# EAGLE design teensy_adapter (EAGLE 9.0.1)
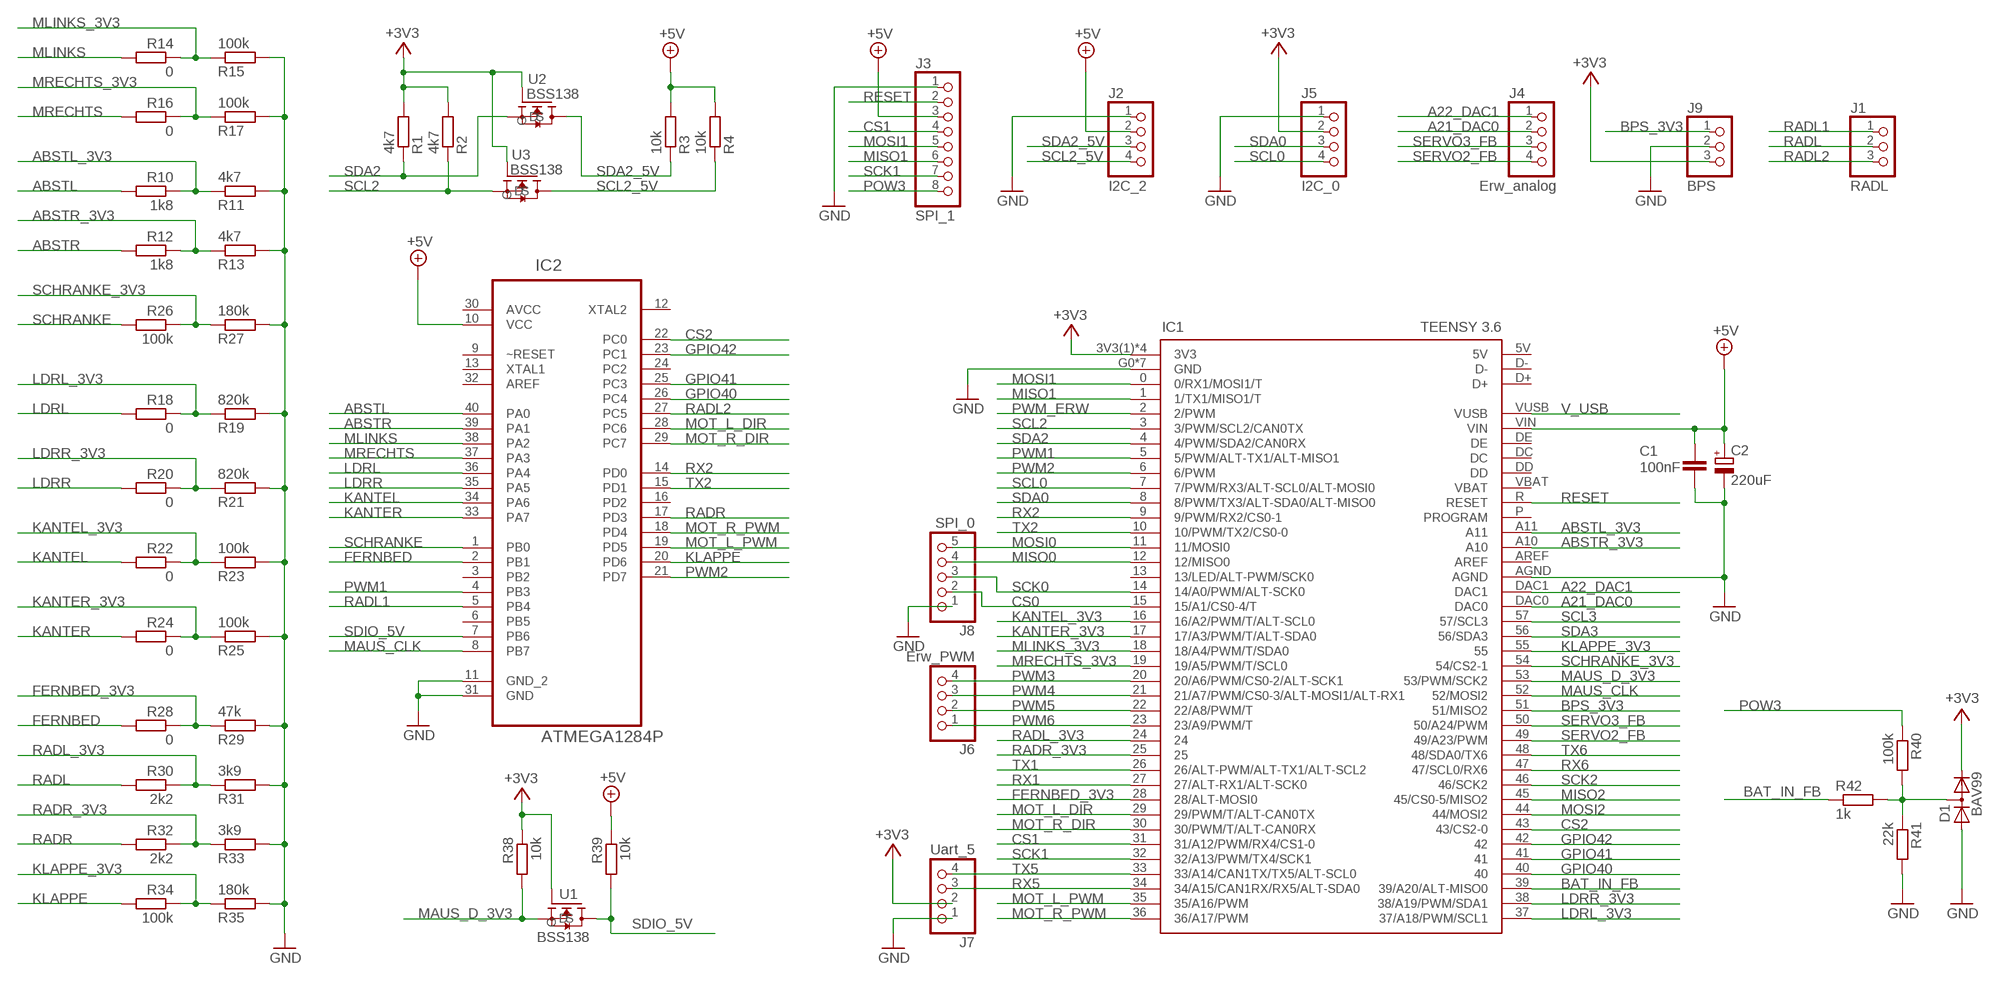
[diagram p0: schematic, sheet 1]

## Parts
C1  100nF  C-EU025-025X050  [C025-025X050]
C2  220uF  CPOL-EUE2.5-6  [E2,5-6]
D1  BAV99  BAV199  [SOT23]
IC1  TEENSY 3.6  TEENSY3_6--ALLPINS  [T36]
IC2  ATMEGA1284P  ATMEGA1284P-PU  [DIP254P1524X483-40]
J1  RADL  PINHD-1X3  [1X03]
J2  I2C_2  PINHD-1X4  [1X04]
J3  SPI_1  PINHD-1X8  [1X08]
J4  Erw_analog  PINHD-1X4  [1X04]
J5  I2C_0  PINHD-1X4  [1X04]
J6  Erw_PWM  PINHD-1X4  [1X04]
J7  Uart_5  PINHD-1X4  [1X04]
J8  SPI_0  PINHD-1X5  [1X05]
J9  BPS  PINHD-1X3  [1X03]
R1  4k7  R-EU_0204/2V  [0204V]
R2  4k7  R-EU_0204/2V  [0204V]
R3  10k  R-EU_0204/2V  [0204V]
R4  10k  R-EU_0204/2V  [0204V]
R10  1k8  R-EU_0204/2V  [0204V]
R11  4k7  R-EU_0204/2V  [0204V]
R12  1k8  R-EU_0204/2V  [0204V]
R13  4k7  R-EU_0204/2V  [0204V]
R14  0  R-EU_0204/2V  [0204V]
R15  100k  R-EU_0204/2V  [0204V]
R16  0  R-EU_0204/2V  [0204V]
R17  100k  R-EU_0204/2V  [0204V]
R18  0  R-EU_0204/2V  [0204V]
R19  820k  R-EU_0204/2V  [0204V]
R20  0  R-EU_0204/2V  [0204V]
R21  820k  R-EU_0204/2V  [0204V]
R22  0  R-EU_0204/2V  [0204V]
R23  100k  R-EU_0204/2V  [0204V]
R24  0  R-EU_0204/2V  [0204V]
R25  100k  R-EU_0204/2V  [0204V]
R26  100k  R-EU_0204/2V  [0204V]
R27  180k  R-EU_0204/2V  [0204V]
R28  0  R-EU_0204/2V  [0204V]
R29  47k  R-EU_0204/2V  [0204V]
R30  2k2  R-EU_0204/2V  [0204V]
R31  3k9  R-EU_0204/2V  [0204V]
R32  2k2  R-EU_0204/2V  [0204V]
R33  3k9  R-EU_0204/2V  [0204V]
R34  100k  R-EU_0204/2V  [0204V]
R35  180k  R-EU_0204/2V  [0204V]
R38  10k  R-EU_0204/2V  [0204V]
R39  10k  R-EU_0204/2V  [0204V]
R40  100k  R-EU_0204/2V  [0204V]
R41  22k  R-EU_0204/2V  [0204V]
R42  1k  R-EU_0204/2V  [0204V]
U1  BSS138  [BSS138]
U2  BSS138  [BSS138]
U3  BSS138  [BSS138]

## Nets
+3V3: D1.2(C) IC1.3V3(1)(3V3) IC1.3V3(2)(3V3) IC1.3V3(3)(3V3) IC1.3V3(4)(3V3) J5.2 J7.2 J9.3 R1.2 R2.2 R38.1 U1.G U2.G U3.G
+5V: C1.1 C2.+ IC1.VIN IC2.10(VCC) J2.2 J3.3 R3.2 R4.2 R39.1
A21_DAC0: IC1.DAC0 J4.2
A22_DAC1: IC1.DAC1 J4.1
ABSTL: IC2.40(PA0) R10.2
ABSTL_3V3: IC1.A11 R10.1 R11.1
ABSTR: IC2.39(PA1) R12.2
ABSTR_3V3: IC1.A10 R12.1 R13.1
BAT_IN_FB: IC1.39(39/A20/ALT-MISO0) R42.1
BPS_3V3: IC1.51(51/MISO2) J9.1
CS0: IC1.15(15/A1/CS0-4/T) J8.2
CS1: IC1.31(31/A12/PWM/RX4/CS1-0) J3.4
CS2: IC1.43(43/CS2-0) IC2.22(PC0)
FERNBED: IC2.2(PB1) R28.2
FERNBED_3V3: IC1.28(28/ALT-MOSI0) R28.1 R29.1
GND: C1.2 C2.- D1.1(A) IC1.AGND IC1.G0(GND) IC1.G1(GND) IC1.G2(GND) IC1.G3(GND) IC1.G4(GND) IC1.G5(GND) IC1.G6(GND) IC2.11(GND_2) IC2.31(GND) J2.1 J3.1 J5.1 J7.1 J8.1 J9.2 R11.2 R13.2 R15.2 R17.2 R19.2 R21.2 R23.2 R25.2 R27.2 R29.2 R31.2 R33.2 R35.2 R41.2
GPIO40: IC1.40 IC2.26(PC4)
GPIO41: IC1.41 IC2.25(PC3)
GPIO42: IC1.42 IC2.23(PC1)
KANTEL: IC2.34(PA6) R22.2
KANTEL_3V3: IC1.16(16/A2/PWM/T/ALT-SCL0) R22.1 R23.1
KANTER: IC2.33(PA7) R24.2
KANTER_3V3: IC1.17(17/A3/PWM/T/ALT-SDA0) R24.1 R25.1
KLAPPE: IC2.20(PD6) R34.2
KLAPPE_3V3: IC1.55 R34.1 R35.1
LDRL: IC2.36(PA4) R18.2
LDRL_3V3: IC1.37(37/A18/PWM/SCL1) R18.1 R19.1
LDRR: IC2.35(PA5) R20.2
LDRR_3V3: IC1.38(38/A19/PWM/SDA1) R20.1 R21.1
MAUS_CLK: IC1.52(52/MOSI2) IC2.8(PB7)
MAUS_D_3V3: IC1.53(53/PWM/SCK2) R38.2 U1.S
MISO0: IC1.12(12/MISO0) J8.4
MISO1: IC1.1(1/TX1/MISO1/T) J3.6
MISO2: IC1.45(45/CS0-5/MISO2)
MLINKS: IC2.38(PA2) R14.2
MLINKS_3V3: IC1.18(18/A4/PWM/T/SDA0) R14.1 R15.1
MOSI0: IC1.11(11/MOSI0) J8.5
MOSI1: IC1.0(0/RX1/MOSI1/T) J3.5
MOSI2: IC1.44(44/MOSI2)
MOT_L_DIR: IC1.29(29/PWM/T/ALT-CAN0TX) IC2.28(PC6)
MOT_L_PWM: IC1.35(35/A16/PWM) IC2.19(PD5)
MOT_R_DIR: IC1.30(30/PWM/T/ALT-CAN0RX) IC2.29(PC7)
MOT_R_PWM: IC1.36(36/A17/PWM) IC2.18(PD4)
MRECHTS: IC2.37(PA3) R16.2
MRECHTS_3V3: IC1.19(19/A5/PWM/T/SCL0) R16.1 R17.1
N$4: D1.3(AC) R40.2 R41.1 R42.2
POW3: J3.8 R40.1
PWM1: IC1.5(5/PWM/ALT-TX1/ALT-MISO1) IC2.4(PB3)
PWM2: IC1.6(6/PWM) IC2.21(PD7)
PWM3: IC1.20(20/A6/PWM/CS0-2/ALT-SCK1) J6.4
PWM4: IC1.21(21/A7/PWM/CS0-3/ALT-MOSI1/ALT-RX1) J6.3
PWM5: IC1.22(22/A8/PWM/T) J6.2
PWM6: IC1.23(23/A9/PWM/T) J6.1
PWM_ERW: IC1.2(2/PWM)
RADL: J1.2 R30.2
RADL1: IC2.5(PB4) J1.1
RADL2: IC2.27(PC5) J1.3
RADL_3V3: IC1.24 R30.1 R31.1
RADR: IC2.17(PD3) R32.2
RADR_3V3: IC1.25 R32.1 R33.1
RESET: IC1.R(RESET) J3.2
RX1: IC1.27(27/ALT-RX1/ALT-SCK0)
RX2: IC1.9(9/PWM/RX2/CS0-1) IC2.14(PD0)
RX5: IC1.34(34/A15/CAN1RX/RX5/ALT-SDA0) J7.3
RX6: IC1.47(47/SCL0/RX6)
SCHRANKE: IC2.1(PB0) R26.2
SCHRANKE_3V3: IC1.54(54/CS2-1) R26.1 R27.1
SCK0: IC1.14(14/A0/PWM/ALT-SCK0) J8.3
SCK1: IC1.32(32/A13/PWM/TX4/SCK1) J3.7
SCK2: IC1.46(46/SCK2)
SCL0: IC1.7(7/PWM/RX3/ALT-SCL0/ALT-MOSI0) J5.4
SCL2: IC1.3(3/PWM/SCL2/CAN0TX) R2.1 U3.S
SCL2_5V: J2.4 R4.1 U3.D
SCL3: IC1.57(57/SCL3)
SDA0: IC1.8(8/PWM/TX3/ALT-SDA0/ALT-MISO0) J5.3
SDA2: IC1.4(4/PWM/SDA2/CAN0RX) R1.1 U2.S
SDA2_5V: J2.3 R3.1 U2.D
SDA3: IC1.56(56/SDA3)
SDIO_5V: IC2.7(PB6) R39.2 U1.D
SERVO2_FB: IC1.49(49/A23/PWM) J4.4
SERVO3_FB: IC1.50(50/A24/PWM) J4.3
TX1: IC1.26(26/ALT-PWM/ALT-TX1/ALT-SCL2)
TX2: IC1.10(10/PWM/TX2/CS0-0) IC2.15(PD1)
TX5: IC1.33(33/A14/CAN1TX/TX5/ALT-SCL0) J7.4
TX6: IC1.48(48/SDA0/TX6)
V_USB: IC1.VUSB
Unconnected: IC1.5V IC1.13(13/LED/ALT-PWM/SCK0) IC1.AREF IC1.D+ IC1.D- IC1.DC IC1.DD IC1.DE IC1.P(PROGRAM) IC1.VBAT IC2.3(PB2) IC2.6(PB5) IC2.9(~RESET) IC2.12(XTAL2) IC2.13(XTAL1) IC2.16(PD2) IC2.24(PC2) IC2.32(AREF)

## Power pins joined to a net without a drawn wire
AVCC: IC2.30(AVCC)

## Library data of the parts
C1 = rcl:C-EU: CAPACITOR, European symbol; SPICEPREFIX: C
C2 = rcl:CPOL-EU: POLARIZED CAPACITOR, European symbol; SPICEPREFIX: C
D1 = diode:BAV199: DIODE low-leakage double diode
IC1 = Teensy_3_6:TEENSY3_6--ALLPINS
IC2 = Atmel_By_element14_Batch_1:ATMEGA1284P-PU: 8-bit Microcontroller with In-System Programmable Flash; MPN: ATMEGA1284P-PU; OC_FARNELL: 1715481; OC_NEWARK: 15R0264; PACKAGE: PDIP-40; SUPPLIER: Atmel
J1 J9 = pinhead_ts:PINHD-1X3: PIN HEADER
J2 J4-J7 = pinhead_ts:PINHD-1X4: PIN HEADER
J3 = pinhead_ts:PINHD-1X8: PIN HEADER
J8 = pinhead_ts:PINHD-1X5: PIN HEADER
R1-R4 R10-R35 R38-R42 = rcl:R-EU_: RESISTOR, European symbol; SPICEPREFIX: R
U1-U3 = Ava:BSS138: BSS138 N-Channel Logic Level Enhancement Mode Field Effect Transistor

## Net classes
0 default: width 0.203 mm

## Board
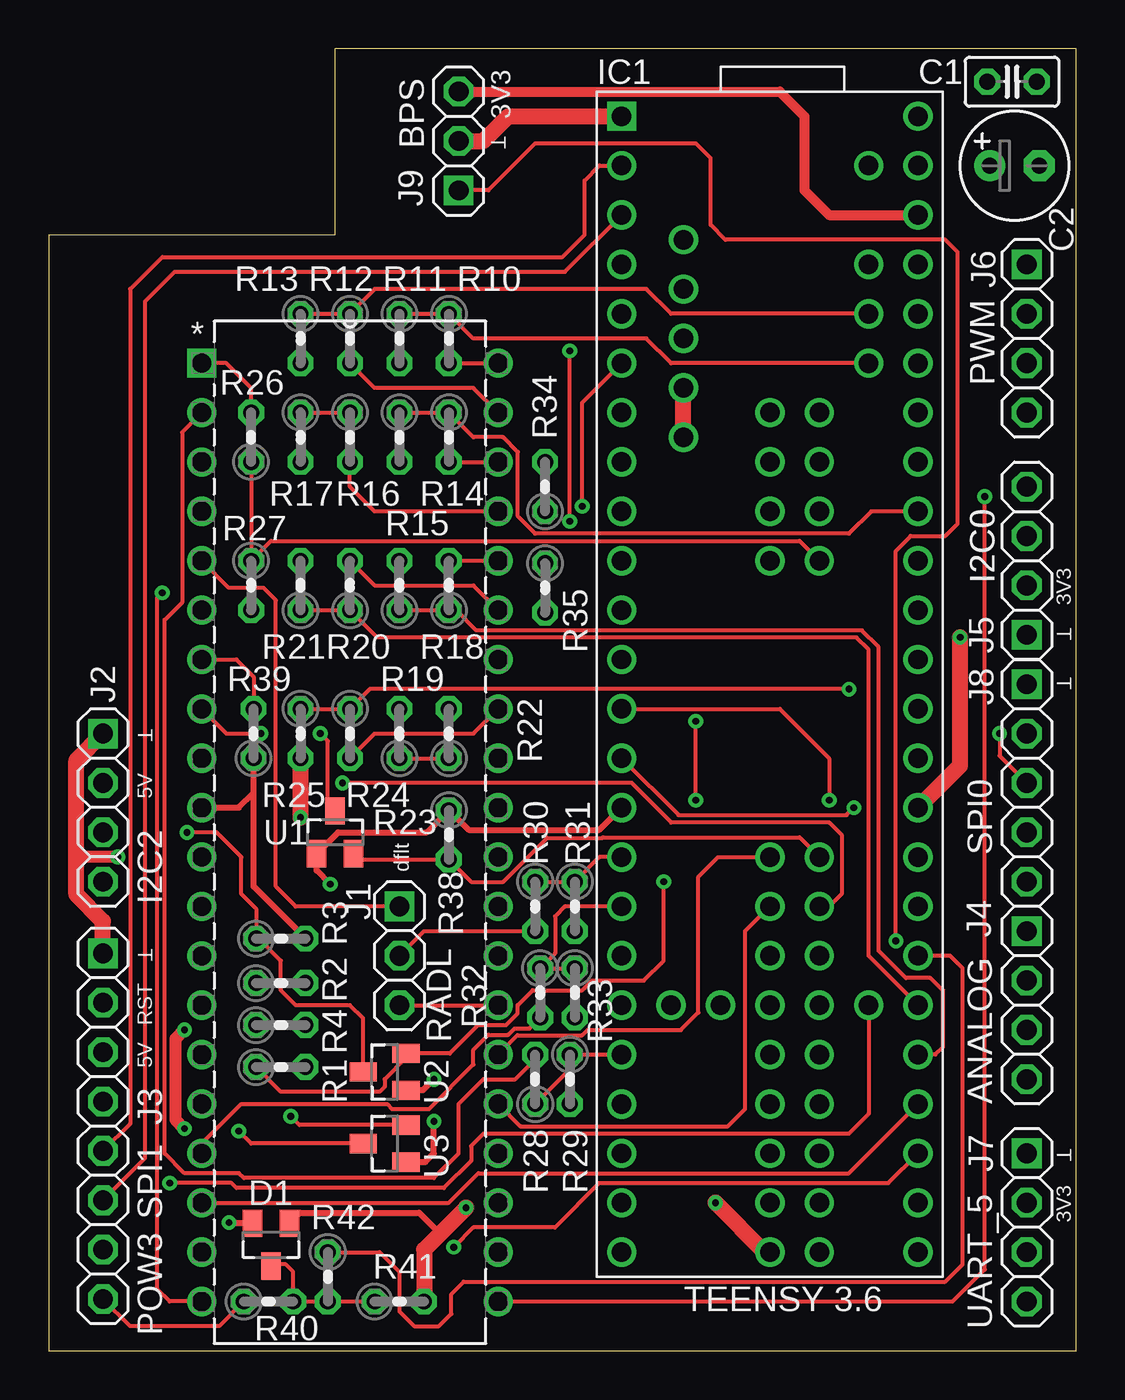
[diagram p1: board, top side]
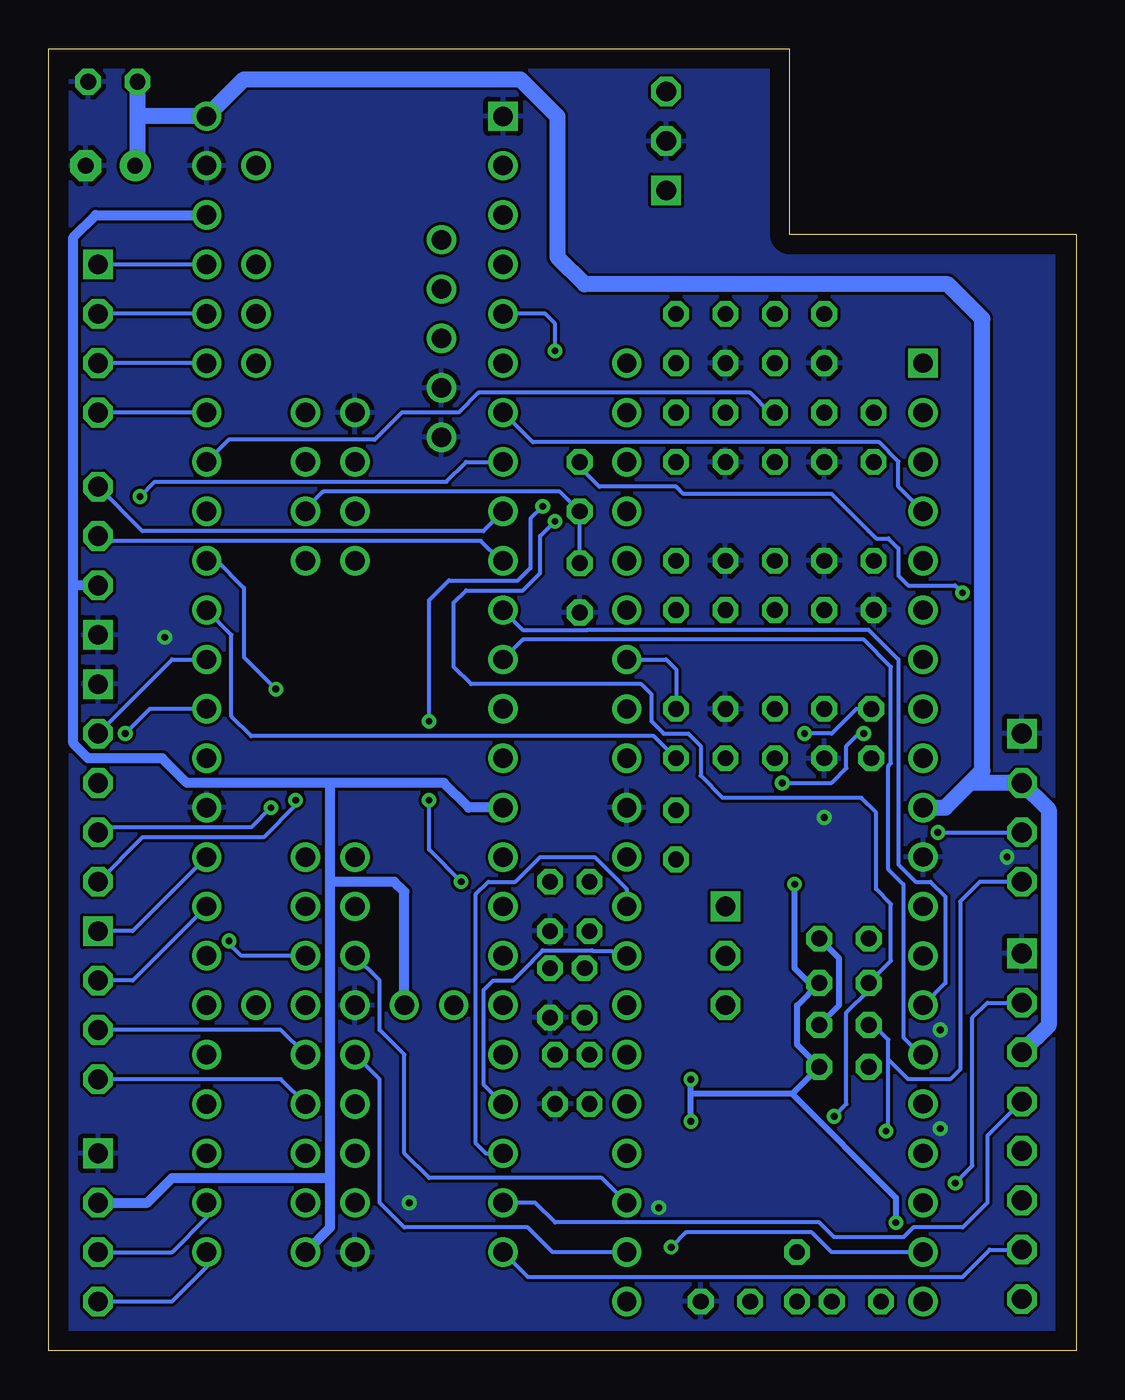
[diagram p2: board, bottom side, seen from below]

Size 52.83 x 66.98 mm. Coordinates in mm from the lower left corner, seen from the top.
Outline: 0,0 52.83,0 52.83,66.98 14.73,66.98 14.73,57.4 0,57.4 0,0
Copper layers (1*16): Top 0.035mm / dielectric 1.5mm / Bottom 0.035mm
Design rules "SeeedStudio_2layer_DRU": minimum track width 6mil, minimum drill 0.35mm, track to track 6mil, track to pad 6mil, pad to pad 6mil, via to via 6mil, smd to smd 6mil, copper to edge 40mil, drill to drill 6mil, minimum pad ring 10mil, minimum via ring 8mil, stop-mask expansion 4mil, vias tented up to drill 0mil, thermal gap 10mil

### Footprints (pad centres in the part's own frame; a part is rotated, then mirrored left to right if it is on the bottom)
C025-025X050 = drill 0.813 octagon: 1 -1.27,0; 2 1.27,0
E2,5-6 = drill 0.813 pad 1.6: + -1.27,0 | drill 0.813 pad 1.6 octagon: - 1.27,0
SOT23 = smd 1 x 1.4: 1 -0.95,-1.1; 2 0.95,-1.1; 3 0,1.1
T36 = drill 1: 0 -26.67,-7.62; 1 -24.13,-7.62; 2 -21.59,-7.62; 3 -19.05,-7.62; 3V3(1) 6.35,-7.62; 3V3(2) 16.51,-2.54; 3V3(3) -24.13,7.62; 3V3(4) 29.21,2.54; 4 -16.51,-7.62; 5 -13.97,-7.62; 5V -22.86,-4.445; 6 -11.43,-7.62; 7 -8.89,-7.62; 8 -6.35,-7.62; 9 -3.81,-7.62; 10 -1.27,-7.62; 11 1.27,-7.62; 12 3.81,-7.62; 13 3.81,7.62; 14 1.27,7.62; 15 -1.27,7.62; 16 -3.81,7.62; 17 -6.35,7.62; 18 -8.89,7.62; 19 -11.43,7.62; 20 -13.97,7.62; 21 -16.51,7.62; 22 -19.05,7.62; 23 -21.59,7.62; 24 8.89,-7.62; 25 11.43,-7.62; 26 13.97,-7.62; 27 16.51,-7.62; 28 19.05,-7.62; 29 21.59,-7.62; 30 24.13,-7.62; 31 26.67,-7.62; 32 29.21,-7.62; 33 29.21,7.62; 34 26.67,7.62; 35 24.13,7.62; 36 21.59,7.62; 37 19.05,7.62; 38 16.51,7.62; 39 13.97,7.62; 40 8.89,0; 41 11.43,0; 42 13.97,0; 43 19.05,0; 44 21.59,0; 45 24.13,0; 46 26.67,0; 47 26.67,2.54; 48 24.13,2.54; 49 21.59,2.54; 50 19.05,2.54; 51 13.97,2.54; 52 11.43,2.54; 53 8.89,2.54; 54 -6.35,2.54; 55 -8.89,2.54; 56 -11.43,2.54; 57 -13.97,2.54; A10 -19.05,5.08; A11 -16.51,5.08; AGND -26.67,7.62; AREF -21.59,5.08; D+ -17.78,-4.445; D- -20.32,-4.445; DAC0 11.43,7.62; DAC1 8.89,7.62; DC -8.89,0; DD -6.35,0; DE -11.43,0; G1 16.51,0; G2 6.35,7.62; G3 29.21,0; G4 -15.24,-4.445; G5 -12.7,-4.445; G6 -13.97,0; P 16.51,2.54; R 16.51,5.08; VBAT 16.51,-5.08; VIN -29.21,7.62; VUSB -26.67,5.08 | drill 1 square: G0 -29.21,-7.62
DIP254P1524X483-40 = drill 0.991 square: 1 -15.24,48.26 | drill 0.991: 2 -15.24,45.72; 3 -15.24,43.18; 4 -15.24,40.64; 5 -15.24,38.1; 6 -15.24,35.56; 7 -15.24,33.02; 8 -15.24,30.48; 9 -15.24,27.94; 10 -15.24,25.4; 11 -15.24,22.86; 12 -15.24,20.32; 13 -15.24,17.78; 14 -15.24,15.24; 15 -15.24,12.7; 16 -15.24,10.16; 17 -15.24,7.62; 18 -15.24,5.08; 19 -15.24,2.54; 20 -15.24,0; 21 0,0; 22 0,2.54; 23 0,5.08; 24 0,7.62; 25 0,10.16; 26 0,12.7; 27 0,15.24; 28 0,17.78; 29 0,20.32; 30 0,22.86; 31 0,25.4; 32 0,27.94; 33 0,30.48; 34 0,33.02; 35 0,35.56; 36 0,38.1; 37 0,40.64; 38 0,43.18; 39 0,45.72; 40 0,48.26
1X03 = drill 1.016 square: 1 -2.54,0 | drill 1.016 octagon: 2 0,0; 3 2.54,0
1X04 = drill 1.016 square: 1 -3.81,0 | drill 1.016 octagon: 2 -1.27,0; 3 1.27,0; 4 3.81,0
1X08 = drill 1.016 square: 1 -8.89,0 | drill 1.016 octagon: 2 -6.35,0; 3 -3.81,0; 4 -1.27,0; 5 1.27,0; 6 3.81,0; 7 6.35,0; 8 8.89,0
1X05 = drill 1.016 square: 1 -5.08,0 | drill 1.016 octagon: 2 -2.54,0; 3 0,0; 4 2.54,0; 5 5.08,0
0204V = drill 0.813 octagon: 1 -1.27,0; 2 1.27,0
BSS138 = smd 1 x 1.4: D 0,1.1; G -0.95,-1.1; S 0.95,-1.1

### Placement (x,y rotation side)
C1  49.53,65.28 0 top
C2  49.66,60.96 0 top
D1  11.43,5.46 180 top
IC1  37.08,34.29 270 top
IC2  23.11,2.54 0 top
J1  18.03,20.32 270 top
J2  2.79,27.94 270 top
J3  2.79,11.56 270 top
J4  50.29,17.78 270 top
J5  50.29,40.64 90 top
J6  50.29,52.07 270 top
J7  50.29,6.35 270 top
J8  50.29,29.21 270 top
J9  21.08,62.23 90 top
R1  11.94,14.61 0 top
R2  11.94,18.92 0 top
R3  11.94,21.21 0 top
R4  11.94,16.76 0 top
R10  20.57,52.07 270 top
R11  18.03,52.07 270 top
R12  15.49,52.07 270 top
R13  12.95,52.07 270 top
R14  20.57,46.99 270 top
R15  18.03,46.99 270 top
R16  15.49,46.99 270 top
R17  12.95,46.99 270 top
R18  20.57,39.37 90 top
R19  18.03,39.37 90 top
R20  15.49,39.37 90 top
R21  12.95,39.37 90 top
R22  20.57,31.75 90 top
R23  18.03,31.75 90 top
R24  15.49,31.75 270 top
R25  12.95,31.75 270 top
R26  10.41,46.99 90 top
R27  10.41,39.37 270 top
R28  25.02,13.97 90 top
R29  26.8,13.97 270 top
R30  25.02,22.86 270 top
R31  27.05,22.86 270 top
R32  25.27,18.41 270 top
R33  27.05,18.41 270 top
R34  25.53,44.45 90 top
R35  25.53,39.24 270 top
R38  20.57,26.54 270 top
R39  10.54,31.75 90 top
R40  11.3,2.54 0 top
R41  18.03,2.54 0 top
R42  14.35,3.81 270 top
U1  14.73,26.67 0 top
U2  17.27,14.35 90 top
U3  17.27,10.67 90 top

### Tracks (layer width: path | path; a pad name or v marks a point on that pad's centre or on a via)
+3V3  (via drill 0.35)
  Top 0.305: IC1.3V3(1) 28.32,26.8 21.59,26.8 R38.1 19.43,26.67 14.88,26.67 U1.G 13.78,24.7 v14.48,24 | U3.G 19.37,9.72 19.81,10.16 v19.81,11.81 | v19.81,13.97 19.24,13.4 U2.G | D1.2 9.31,6.56 v9.27,6.6
  Top 0.508: J9.3 37.59,64.77 38.86,63.5 38.86,59.69 40.13,58.42 IC1.3V3(3)
  Bottom 0.305: v14.48,24 14.48,19.68 13.72,18.92 R2.2 14.35,17.78 14.35,15.75 R1.2 14.61,13.21 | v19.81,11.81 19.81,13.21 | 19.81,13.21 v19.81,13.97 | 14.61,13.21 19.81,13.21 | v9.27,6.6 9.27,7.87 14.61,13.21
  Bottom 0.508: IC1.3V3(1) 31.24,27.94 32.51,29.21 38.48,29.21 | IC1.3V3(4) 38.35,6.35 38.35,8.89 | 38.48,29.21 38.35,29.08 38.35,24.13 | 38.35,8.89 38.35,24.13 | IC1.3V3(2) 34.54,23.62 35.05,24.13 38.35,24.13 | IC1.3V3(3) 50.42,58.42 51.56,57.28 51.56,39.37 | J7.2 47.75,7.62 46.48,8.89 38.35,8.89 | J5.2 51.56,39.37 | 38.48,29.21 45.72,29.21 46.99,30.48 50.8,30.48 51.56,31.24 51.56,39.37
+5V
  Top 0.305: IC2.10 9.78,27.94 10.54,28.7 | 10.54,28.7 R39.1 | R3.2 10.54,23.88 10.54,28.7
  Bottom 0.305: R4.2 12.19,17.78 12.19,20.19 R3.2
  Bottom 0.813: IC2.10 6.73,27.94 5.46,29.21 | 5.46,29.21 J2.2 1.42,27.84 1.42,16.74 J3.3 | 48.26,63.5 IC1.VIN 42.8,65.41 28.57,65.41 26.67,63.5 26.67,56.26 25.27,54.86 6.6,54.86 4.83,53.09 4.83,29.84 5.46,29.21 | C2.+ 48.26,61.09 48.26,63.5 | 48.26,63.5 C1.1
A21_DAC0
  Bottom 0.203: IC1.DAC0 48.51,19.05 J4.2
A22_DAC1
  Bottom 0.203: IC1.DAC1 48.51,21.59 J4.1
ABSTL
  Top 0.203: R10.2 IC2.40
ABSTL_3V3
  Top 0.203: R11.1 R10.1 21.84,52.07 30.73,52.07 32,50.8 IC1.A11
ABSTR
  Top 0.203: IC2.39 21.84,49.53 16.76,49.53 R12.2
ABSTR_3V3
  Top 0.203: IC1.A10 32,53.34 30.73,54.61 16.76,54.61 R12.1 R13.1
BAT_IN_FB
  Top 0.203: R42.1 17.02,5.08 18.03,4.06 18.03,2.03 18.8,1.27 20.07,1.27 20.7,1.91 20.7,2.92 21.34,3.56 46.1,3.56 46.99,4.45 46.99,19.68 46.36,20.32 IC1.39
BPS_3V3  (via drill 0.35)
  Top 0.203: v43.56,21.08 43.56,41.15 44.32,41.91 46.1,41.91 46.74,42.55 46.74,56.52 46.1,57.15 34.8,57.15 34.04,57.91 34.04,61.34 33.27,62.1 25.02,62.1 22.61,59.69 J9.1
  Bottom 0.203: v43.56,21.08 43.56,20.95 42.93,20.32 IC1.51
CS0
  Bottom 0.203: J8.2 46.48,35.56 IC1.15
CS1
  Bottom 0.203: IC1.31 27.81,7.62 26.8,6.6 13.21,6.6 12.45,5.84 8.89,5.84 8.38,6.35 5.84,6.35 4.57,7.62 4.57,11.05 J3.4
CS2
  Bottom 0.203: IC2.22 26.92,5.08 28.19,6.35 34.54,6.35 35.81,7.62 35.81,13.97 IC1.43
FERNBED
  Top 0.203: IC2.2 6.86,47.24 6.86,38.48 5.97,37.59 5.97,10.16 6.98,9.14 9.78,9.14 10.03,8.89 19.81,8.89 21.08,10.16 21.08,12.7 22.35,13.97 24,13.97 25.02,14.99 R28.2
FERNBED_3V3
  Top 0.203: IC1.28 R29.1 26.8,14.48 R28.1
GND  (via drill 0.35 pad 0.65)
  Top 0.305: D1.1 12.93,7.11 19.05,7.11 20.13,6.03
  Top 0.61: v3.56,25.4 1.42,25.4 | v6.98,11.43 6.53,11.89 6.53,16.05 v6.98,16.51
  Top 0.813: v12.95,27.43 R25.2 | J3.1 2.79,22.1 1.42,23.47 1.42,25.4 1.42,30.38 J2.1 | v21.46,7.37 20.13,6.03 19.3,5.21 R41.2 | J9.2 22.35,62.23 23.62,63.5 IC1.G0 | IC1.G2 46.86,30.1 v46.86,36.7 | IC1.G5 IC1.G4 | v34.29,7.62 36.83,5.08 IC1.G3
  pour Bottom: 1.14,66.6 52.45,66.6 52.45,0.13 1.14,0
GPIO40
  Top 0.203: IC1.40 34.42,25.4 33.4,24.38 33.4,17.4 32.51,16.51 27.71,16.51 27.43,16.23 24.11,16.23 IC2.26
GPIO41
  Top 0.203: IC1.41 35.81,21.59 35.81,12.45 34.92,11.56 24.26,11.56 IC2.25
GPIO42
  Bottom 0.203: IC2.23 24.38,8.89 33.27,8.89 34.54,10.16 34.54,15.24 35.81,16.51 35.81,19.05 IC1.42
KANTEL
  Bottom 0.203: R22.2 20.57,35.05 21.08,35.56 IC2.34
KANTEL_3V3
  Top 0.203: R23.1 R22.1
  Bottom 0.203: R22.1 21.72,31.62 42.42,31.62 43.43,32.64 43.43,36.83 IC1.16
KANTER
  Top 0.203: R24.2 16.76,31.75 21.84,31.75 IC2.33
KANTER_3V3  (via drill 0.35)
  Top 0.203: R25.1 R24.1 16.51,34.04 v41.15,34.04
  Bottom 0.203: IC1.17 44.2,40.64 42.8,39.24 42.8,35.69 v41.15,34.04
KLAPPE  (via drill 0.35)
  Top 0.203: IC2.20 6.22,2.54 5.59,3.17 5.59,38.73 v5.84,38.99
  Bottom 0.203: R34.2 25.53,45.47 24.51,44.45 20.57,44.45 20.19,44.07 12.57,44.07 10.67,42.16 10.41,41.91 10.29,41.78 9.65,41.78 9.14,41.27 9.14,39.88 8.64,39.37 6.22,39.37 v5.84,38.99
KLAPPE_3V3
  Bottom 0.203: R35.1 R34.1 26.54,44.2 38.73,44.2 39.62,43.31 IC1.55
LDRL
  Top 0.203: R18.2 IC2.36
LDRL_3V3
  Top 0.203: R19.1 R18.1 20.96,38.1 22,37.06 41.81,37.06 42.67,36.2 42.67,20.57 44.07,19.18 45.34,19.18 45.97,18.54 45.97,15.62 45.59,15.24 IC1.37
LDRR
  Top 0.203: R20.2 16.76,39.37 21.84,39.37 IC2.35
LDRR_3V3
  Top 0.203: R21.1 R20.1 16.89,36.7 41.53,36.7 42.16,36.07 42.16,20.32 IC1.38
MAUS_CLK  (via drill 0.35)
  Top 0.203: IC2.8 9.14,31.75 v10.92,31.75 | IC1.52 40.13,22.86 40.77,23.5 40.77,26.54 40.13,27.18 32,27.18 29.97,29.21 v15.11,29.21
  Bottom 0.203: v15.11,29.21 12.57,29.21 11.81,29.97 11.81,31.11 11.18,31.75 v10.92,31.75
MAUS_D_3V3
  Top 0.203: U1.S 15.98,25.27 R38.2 21.72,24.13 23.37,24.13 25.63,26.39 28.49,26.39 28.52,26.42 38.61,26.42 IC1.53
MISO0  (via drill 0.35)
  Top 0.203: v41.4,27.94 41.02,27.56 32.38,27.56 IC1.12
  Bottom 0.203: v41.4,27.94 42.42,26.92 50.04,26.92 J8.4
MISO1
  Top 0.203: IC1.1 26.54,55.5 6.48,55.5 4.95,53.98 4.95,11.43 4.95,10.92 4.95,9.91 J3.6
MLINKS
  Top 0.203: R14.2 IC2.38
MLINKS_3V3
  Top 0.203: R15.1 R14.1 21.84,46.99 23.37,46.99 24.13,46.23 24.13,42.93 25.02,42.04 41.15,42.04 42.29,43.18 IC1.18
MOSI0  (via drill 0.35)
  Top 0.203: IC1.11 37.59,33.02 40.13,30.48 v40.13,28.32
  Bottom 0.203: v40.13,28.32 40.13,28.07 41.78,26.42 48.01,26.42 J8.5
MOSI1
  Top 0.203: IC1.0 28.32,60.96 27.56,60.2 27.56,57.4 26.42,56.26 5.84,56.26 4.19,54.61 4.19,11.68 J3.5
MOT_L_DIR
  Bottom 0.203: IC1.29 30.48,13.72 30.48,18.54 29.97,19.05 28.96,19.05 27.96,20.04 27.96,20.06 27.43,20.6 24.89,20.6 24.87,20.57 23.37,20.57 IC2.28
MOT_L_PWM  (via drill 0.35)
  Top 0.203: IC1.35 43.18,8.64 28.32,8.64 26.04,6.35 21.84,6.35 v20.83,5.33
  Bottom 0.203: IC2.19 12.57,5.08 13.59,6.1 20.07,6.1 v20.83,5.33
MOT_R_DIR
  Bottom 0.203: IC1.30 30.35,10.16 30.86,10.67 30.86,23.5 30.23,24.13 28.83,24.13 27.56,25.4 24.77,25.4 23.11,23.75 IC2.29
MOT_R_PWM
  Top 0.203: IC2.18 20.57,7.62 22.1,9.14 41.15,9.14 IC1.36
MRECHTS
  Top 0.203: IC2.37 16.76,43.18 15.49,44.45 R16.2
MRECHTS_3V3
  Top 0.203: R17.1 R16.1
  Bottom 0.203: R16.1 15.75,48.26 16.76,49.28 30.73,49.28 31.75,48.26 34.67,48.26 36.07,46.86 43.56,46.86 IC1.19
N$4
  Top 0.203: D1.3 11.51,4.45 12.19,4.45 12.57,4.06 R40.2 R42.2 R41.1
POW3
  Top 0.203: R40.1 8.76,1.27 4.19,1.27 J3.8
PWM1
  Bottom 0.203: IC1.5 27.94,46.74 10.14,46.74 9.14,45.74 9.14,44.45 IC2.4
PWM2  (via drill 0.35)
  Top 0.203: IC2.21 46.48,2.54 48.13,4.19 v48.13,43.94
  Bottom 0.203: v48.13,43.94 47.37,44.7 32.38,44.7 31.37,45.72 IC1.6
PWM3
  Bottom 0.203: IC1.20 J6.4
PWM4
  Bottom 0.203: IC1.21 J6.3
PWM5
  Bottom 0.203: IC1.22 J6.2
PWM6
  Bottom 0.203: IC1.23 J6.1
RADL
  Top 0.203: J1.2 19.3,21.59 R30.2
RADL1
  Top 0.203: J1.1 12.7,22.86 11.68,23.88 11.68,38.61 11.05,39.24 9.27,39.24 IC2.5
RADL2
  Top 0.203: J1.3 IC2.27
RADL_3V3
  Top 0.203: R30.1 R31.1 28.32,25.4 IC1.24
RADR
  Top 0.203: IC2.17 7.87,10.67 9.91,12.7 17.4,12.7 17.65,12.45 19.56,12.45 21.84,14.73 21.84,15.49 22.61,16.26 23.63,16.26 23.96,16.59 24.71,16.59 R32.2
RADR_3V3
  Top 0.203: R33.1 R32.1 26.04,20.45 26.04,22.35 26.54,22.86 IC1.25
RESET  (via drill 0.35)
  Top 0.203: IC1.R 42.16,12.19 41.15,11.18 22.35,11.18 21.72,10.54 21.72,9.78 20.32,8.38 9.65,8.38 9.4,8.64 v6.22,8.64
  Bottom 0.203: v6.22,8.64 5.33,9.53 5.33,17.14 4.57,17.91 J3.2
RX2
  Bottom 0.203: IC2.14 6.73,18.92 6.73,23.37 7.49,24.13 8.26,24.13 9.14,25.02 9.14,35.56 10.67,37.08 25.12,37.08 25.15,37.06 28.42,37.06 IC1.9
RX5
  Bottom 0.203: J7.3 46.48,5.08 44.7,6.86 IC1.34
SCHRANKE
  Top 0.203: R26.2 10.41,49.53 9.14,50.8 IC2.1
SCHRANKE_3V3
  Top 0.203: R26.1 R27.1 11.43,41.66 38.61,41.66 IC1.54
SCK0  (via drill 0.35)
  Top 0.203: v48.9,31.75 48.9,30.61 J8.3
  Bottom 0.203: IC1.14 47.62,33.02 v48.9,31.75
SCK1
  Bottom 0.203: IC1.32 28.19,3.81 5.84,3.81 4.45,5.21 J3.7
SCL0
  Bottom 0.203: IC1.7 30.48,42.16 48.01,42.16 J5.4
SCL2  (via drill 0.35)
  Top 0.203: U3.S 12.89,11.62 v12.45,12.06 | v26.8,42.67 v26.8,51.44
  Bottom 0.203: v12.45,12.06 11.81,12.7 11.81,17.4 10.67,18.54 R2.1 9.53,20.07 9.53,22.99 10.29,23.75 10.29,27.69 11.05,28.45 18.16,28.45 19.3,29.59 19.3,31.11 19.94,31.75 21.21,31.75 21.84,32.38 21.84,33.78 22.35,34.29 31.12,34.29 32,35.18 32,38.48 31.37,39.12 28.45,39.12 27.56,40.01 27.56,41.91 v26.8,42.67 | v26.8,51.44 26.8,52.83 27.3,53.34 IC1.3
SCL2_5V  (via drill 0.35)
  Top 0.203: U3.D 10.41,10.67 v9.78,11.3
  Bottom 0.203: J2.4 4.95,24.13 5.97,23.11 5.97,14.48 6.48,13.97 8.64,13.97 9.65,14.99 | 9.65,14.99 9.65,16 10.41,16.76 R4.1 | v9.78,11.3 9.65,11.43 9.65,14.99
SDA0
  Bottom 0.203: IC1.8 29.59,40.64 30.61,41.66 50.04,41.66 J5.3
SDA2  (via drill 0.35)
  Top 0.203: R1.1 11.94,13.34 17.02,13.34 17.27,13.59 17.27,13.97 18.37,15.07 U2.S 20.64,15.3 22.1,16.76 23.52,16.76 24.12,17.36 24.12,17.78 24.88,18.54 27.43,18.54 27.94,19.05 30.61,19.05 31.62,20.07 v31.62,24.13 | v33.27,28.32 v33.27,32.38 | v27.43,43.43 27.43,48.77 IC1.4
  Bottom 0.203: v33.27,28.32 33.27,25.78 v31.62,24.13 | v33.27,32.38 33.27,38.61 32.26,39.62 28.7,39.62 28.07,40.26 28.07,42.8 v27.43,43.43
SDA2_5V  (via drill 0.35)
  Top 0.203: U2.D 16.17,17.1 15.49,17.78 12.7,17.78 11.94,18.54 11.94,20.07 10.79,21.21 | v7.11,26.67 8.64,26.67 9.91,25.4 9.91,23.5 10.67,22.73 10.67,21.34 10.79,21.21 | 10.79,21.21 R3.1
  Bottom 0.203: v7.11,26.67 J2.3
SDIO_5V  (via drill 0.35)
  Top 0.203: IC2.7 9.65,35.56 10.54,34.67 R39.2 | U1.D 14.35,28.15 14.35,31.37 v13.97,31.75
  Bottom 0.203: R39.2 11.3,33.02 12.57,31.75 v13.97,31.75
SERVO2_FB
  Bottom 0.203: IC1.49 40.89,13.97 J4.4
SERVO3_FB
  Bottom 0.203: IC1.50 40.89,16.51 J4.3
TX2
  Bottom 0.203: IC1.10 28.45,36.58 10.92,36.58 9.53,35.18 9.53,30.23 9.63,30.12 9.63,30.1 9.65,30.08 9.65,24.77 8.89,24 8.89,16.13 8,15.24 IC2.15
TX5
  Bottom 0.203: J7.4 46.48,2.54 44.7,4.32 IC1.33

### Text on the board
tNames: 3V3 | BPS | T | PWM | 3V3 | I2C0 | I2C0 | T | T | T | 5V | I2C2 | U1 | SPI0 | dflt | T | RADL | RST | 5V | U2 | ANALOG | SPI1 | T | U3 | 3V3 | POW3 | TEENSY 3.6 | UART_5